# Altium project Kivipallur.PrjPcb
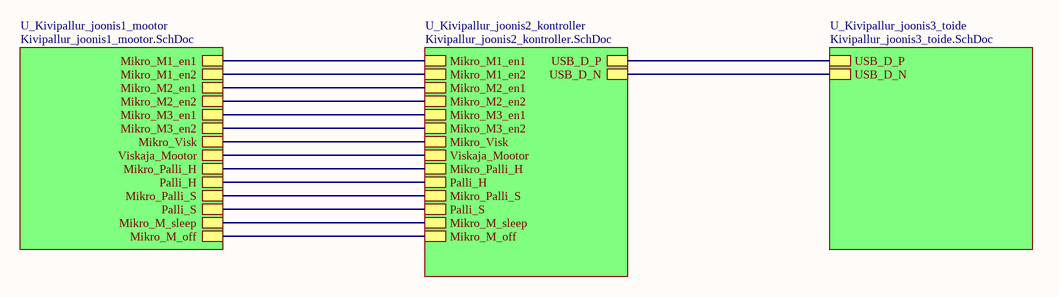
[diagram p0: Kivipallur_joonis4.SchDoc]
4 sheets, 108 parts. Net scope: hierarchical (ports join the sheet entries above them; power ports are global).
Board file: Kivipallur_plaat.PcbDoc
Sheets:
  Kivipallur_joonis4.SchDoc
    U_Kivipallur_joonis1_mootor = Kivipallur_joonis1_mootor.SchDoc
    U_Kivipallur_joonis2_kontroller = Kivipallur_joonis2_kontroller.SchDoc
    U_Kivipallur_joonis3_toide = Kivipallur_joonis3_toide.SchDoc

## Sheet Kivipallur_joonis4.SchDoc
size A4; SheetNumber: 1; SheetTotal: 4

### Sub-sheets
U_Kivipallur_joonis1_mootor = Kivipallur_joonis1_mootor.SchDoc: Mikro_M1_en1, Mikro_M1_en2, Mikro_M2_en1, Mikro_M2_en2, Mikro_M3_en1, Mikro_M3_en2, Mikro_M_sleep, Mikro_M_off, Mikro_Visk, Mikro_Palli_S, Mikro_Palli_H, Viskaja_Mootor, Palli_S, Palli_H
U_Kivipallur_joonis2_kontroller = Kivipallur_joonis2_kontroller.SchDoc: Mikro_M_sleep, Mikro_Visk, Mikro_M3_en2, Mikro_M3_en1, Mikro_M2_en2, Mikro_M2_en1, Mikro_M1_en2, Mikro_M1_en1, Mikro_M_off, USB_D_P, USB_D_N, Viskaja_Mootor, Palli_H, Palli_S, Mikro_Palli_H, Mikro_Palli_S
U_Kivipallur_joonis3_toide = Kivipallur_joonis3_toide.SchDoc: USB_D_P, USB_D_N

### Nets
USB_D_N: sheet U_Kivipallur_joonis2_kontroller/USB_D_N, sheet U_Kivipallur_joonis3_toide/USB_D_N
USB_D_P: sheet U_Kivipallur_joonis2_kontroller/USB_D_P, sheet U_Kivipallur_joonis3_toide/USB_D_P
NetJ9_2: sheet U_Kivipallur_joonis1_mootor/Palli_H, sheet U_Kivipallur_joonis2_kontroller/Palli_H
NetJ11_2: sheet U_Kivipallur_joonis1_mootor/Palli_S, sheet U_Kivipallur_joonis2_kontroller/Palli_S
NetJ14_2: sheet U_Kivipallur_joonis1_mootor/Viskaja_Mootor, sheet U_Kivipallur_joonis2_kontroller/Viskaja_Mootor
NetU4_3: sheet U_Kivipallur_joonis1_mootor/Mikro_Visk, sheet U_Kivipallur_joonis2_kontroller/Mikro_Visk
NetU4_4: sheet U_Kivipallur_joonis1_mootor/Mikro_Palli_S, sheet U_Kivipallur_joonis2_kontroller/Mikro_Palli_S
NetU4_5: sheet U_Kivipallur_joonis1_mootor/Mikro_Palli_H, sheet U_Kivipallur_joonis2_kontroller/Mikro_Palli_H
NetU5_3: sheet U_Kivipallur_joonis1_mootor/Mikro_M1_en1, sheet U_Kivipallur_joonis2_kontroller/Mikro_M1_en1
NetU5_4: sheet U_Kivipallur_joonis1_mootor/Mikro_M1_en2, sheet U_Kivipallur_joonis2_kontroller/Mikro_M1_en2
NetU5_5: sheet U_Kivipallur_joonis1_mootor/Mikro_M2_en1, sheet U_Kivipallur_joonis2_kontroller/Mikro_M2_en1
NetU5_6: sheet U_Kivipallur_joonis1_mootor/Mikro_M2_en2, sheet U_Kivipallur_joonis2_kontroller/Mikro_M2_en2
NetU6_3: sheet U_Kivipallur_joonis1_mootor/Mikro_M3_en1, sheet U_Kivipallur_joonis2_kontroller/Mikro_M3_en1
NetU6_4: sheet U_Kivipallur_joonis1_mootor/Mikro_M3_en2, sheet U_Kivipallur_joonis2_kontroller/Mikro_M3_en2
NetU6_5: sheet U_Kivipallur_joonis1_mootor/Mikro_M_sleep, sheet U_Kivipallur_joonis2_kontroller/Mikro_M_sleep
NetU6_6: sheet U_Kivipallur_joonis1_mootor/Mikro_M_off, sheet U_Kivipallur_joonis2_kontroller/Mikro_M_off

## Sheet Kivipallur_joonis1_mootor.SchDoc
size A4; SheetNumber: 2; SheetTotal: 4
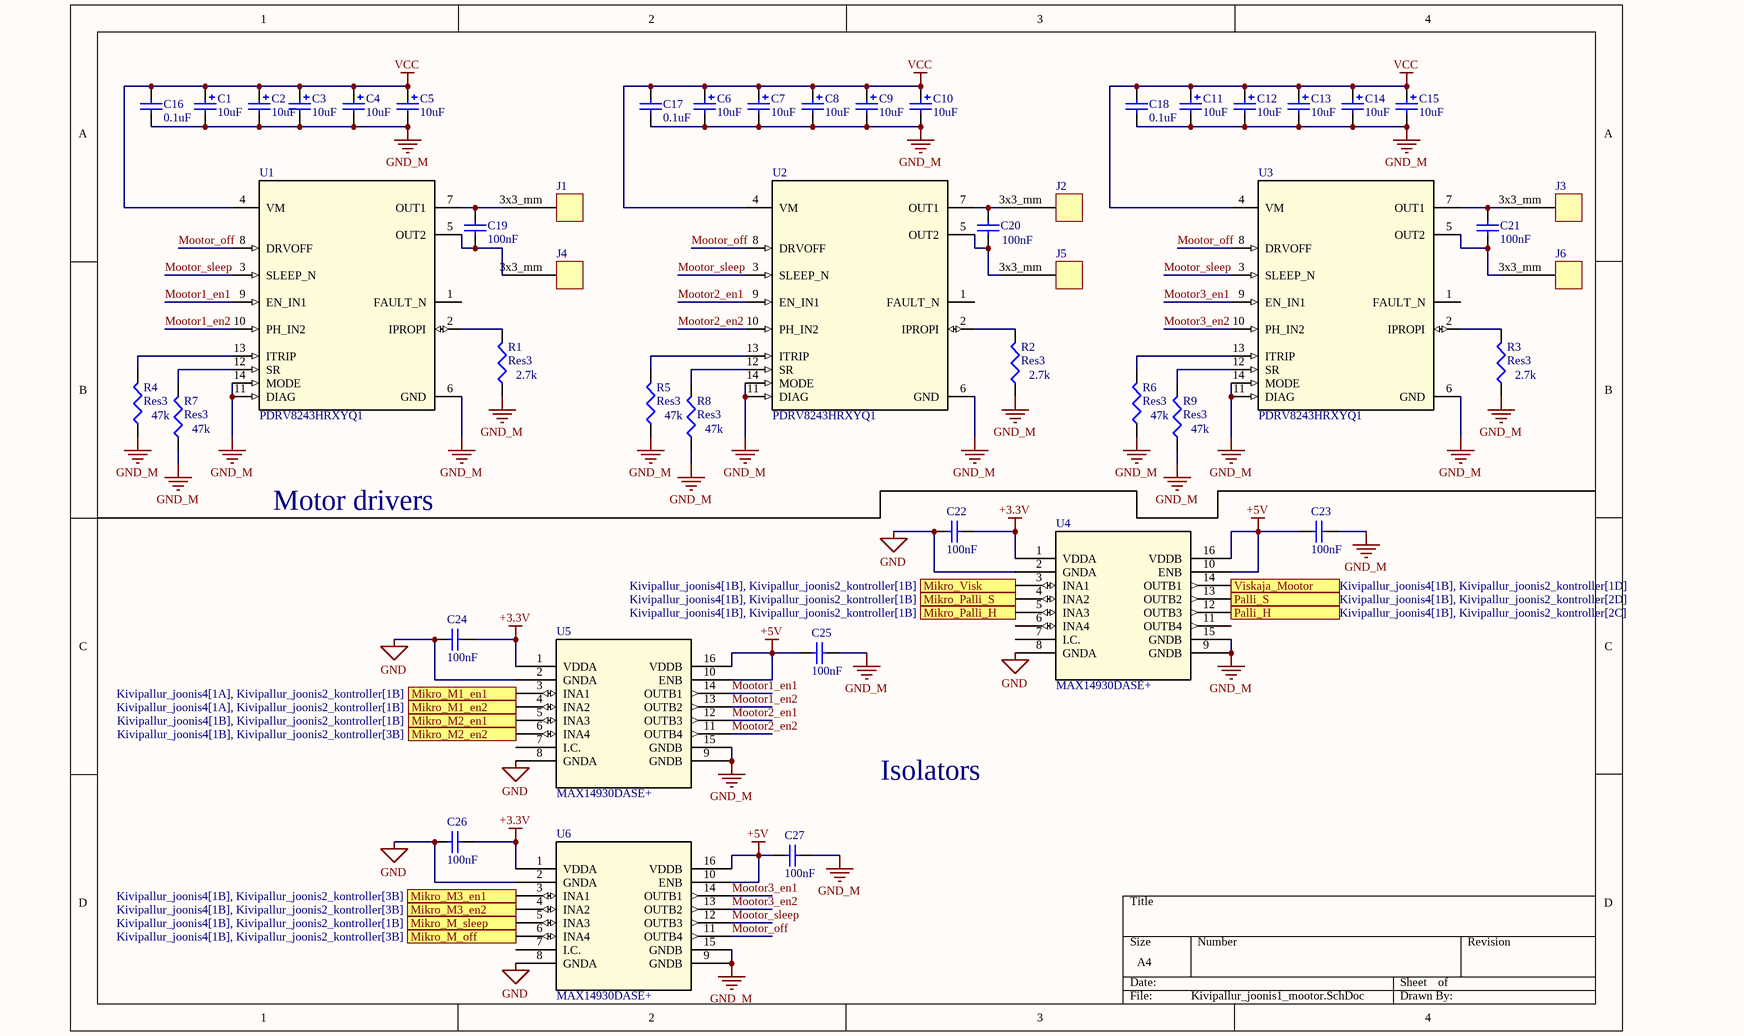
[diagram p1: Kivipallur_joonis1_mootor.SchDoc]

### Parts
C1  value 10uF  [C0805]  (hidden comment: Cap Pol3)
C2  value 10uF  [C0805]  (hidden comment: Cap Pol3)
C3  value 10uF  [C0805]  (hidden comment: Cap Pol3)
C4  value 10uF  [C0805]  (hidden comment: Cap Pol3)
C5  value 10uF  [C0805]  (hidden comment: Cap Pol3)
C6  value 10uF  [C0805]  (hidden comment: Cap Pol3)
C7  value 10uF  [C0805]  (hidden comment: Cap Pol3)
C8  value 10uF  [C0805]  (hidden comment: Cap Pol3)
C9  value 10uF  [C0805]  (hidden comment: Cap Pol3)
C10  value 10uF  [C0805]  (hidden comment: Cap Pol3)
C11  value 10uF  [C0805]  (hidden comment: Cap Pol3)
C12  value 10uF  [C0805]  (hidden comment: Cap Pol3)
C13  value 10uF  [C0805]  (hidden comment: Cap Pol3)
C14  value 10uF  [C0805]  (hidden comment: Cap Pol3)
C15  value 10uF  [C0805]  (hidden comment: Cap Pol3)
C16  value 0.1uF  [1608[0603]]  (hidden comment: Cap Semi)
C17  value 0.1uF  [1608[0603]]  (hidden comment: Cap Semi)
C18  value 0.1uF  [1608[0603]]  (hidden comment: Cap Semi)
C19  value 100nF  [1608[0603]]  (hidden comment: Cap Semi)
C20  value 100nF  [1608[0603]]  (hidden comment: Cap Semi)
C21  value 100nF  [1608[0603]]  (hidden comment: Cap Semi)
C22  value 100nF  [1608[0603]]  (hidden comment: Cap Semi)
C23  value 100nF  [1608[0603]]  (hidden comment: Cap Semi)
C24  value 100nF  [1608[0603]]  (hidden comment: Cap Semi)
C25  value 100nF  [1608[0603]]  (hidden comment: Cap Semi)
C26  value 100nF  [1608[0603]]  (hidden comment: Cap Semi)
C27  value 100nF  [1608[0603]]  (hidden comment: Cap Semi)
J1  3x3_mm  [3x3_mm]  (value not drawn)
J2  3x3_mm  [3x3_mm]  (value not drawn)
J3  3x3_mm  [3x3_mm]  (value not drawn)
J4  3x3_mm  [3x3_mm]  (value not drawn)
J5  3x3_mm  [3x3_mm]  (value not drawn)
J6  3x3_mm  [3x3_mm]  (value not drawn)
R1  Res3  value 2.7k  [J1-0603]
R2  Res3  value 2.7k  [J1-0603]
R3  Res3  value 2.7k  [J1-0603]
R4  Res3  value 47k  [J1-0603]
R5  Res3  value 47k  [J1-0603]
R6  Res3  value 47k  [J1-0603]
R7  Res3  value 47k  [J1-0603]
R8  Res3  value 47k  [J1-0603]
R9  Res3  value 47k  [J1-0603]
U1  PDRV8243HRXYQ1  [RXY0014A-MFG]
U2  PDRV8243HRXYQ1  [RXY0014A-MFG]
U3  PDRV8243HRXYQ1  [RXY0014A-MFG]
U4  MAX14930DASE+  [21-0041_S16+1_MXM]
U5  MAX14930DASE+  [21-0041_S16+1_MXM]
U6  MAX14930DASE+  [21-0041_S16+1_MXM]

### Ports
Mikro_M1_en1 (see Kivipallur_joonis4[1A], Kivipallur_joonis2_kontroller[1B]), Mikro_M1_en2 (see Kivipallur_joonis4[1A], Kivipallur_joonis2_kontroller[1B]), Mikro_M2_en1 (see Kivipallur_joonis4[1B], Kivipallur_joonis2_kontroller[1B]), Mikro_M2_en2 (see Kivipallur_joonis4[1B], Kivipallur_joonis2_kontroller[3B]), Mikro_M3_en1 (see Kivipallur_joonis4[1B], Kivipallur_joonis2_kontroller[3B]), Mikro_M3_en2 (see Kivipallur_joonis4[1B], Kivipallur_joonis2_kontroller[3B]), Mikro_M_off (see Kivipallur_joonis4[1B], Kivipallur_joonis2_kontroller[3B]), Mikro_M_sleep (see Kivipallur_joonis4[1B], Kivipallur_joonis2_kontroller[1B]), Mikro_Palli_H (see Kivipallur_joonis4[1B], Kivipallur_joonis2_kontroller[1B]), Mikro_Palli_S (see Kivipallur_joonis4[1B], Kivipallur_joonis2_kontroller[1B]), Mikro_Visk (see Kivipallur_joonis4[1B], Kivipallur_joonis2_kontroller[1B]), Palli_H (see Kivipallur_joonis4[1B], Kivipallur_joonis2_kontroller[2C]), Palli_S (see Kivipallur_joonis4[1B], Kivipallur_joonis2_kontroller[2D]), Viskaja_Mootor (see Kivipallur_joonis4[1B], Kivipallur_joonis2_kontroller[1D])

### Nets
+3.3V: C22.2 C24.2 C26.2 U4.1(VDDA) U5.1(VDDA) U6.1(VDDA)
+5V: C23.1 C25.1 C27.1 U4.10(ENB) U4.16(VDDB) U5.10(ENB) U5.16(VDDB) U6.10(ENB) U6.16(VDDB)
GND: C22.1 C24.1 C26.1 U4.2(GNDA) U4.8(GNDA) U5.2(GNDA) U5.8(GNDA) U6.2(GNDA) U6.8(GNDA)
GND_M: C1.2 C2.2 C3.2 C4.2 C5.2 C6.2 C7.2 C8.2 C9.2 C10.2 C11.2 C12.2 C13.2 C14.2 C15.2 C16.1 C17.1 C18.1 C23.2 C25.2 C27.2 R1.1 R2.1 R3.1 R4.1 R5.1 R6.1 R7.1 R8.1 R9.1 U1.6(GND) U1.11(DIAG) U1.14(MODE) U2.6(GND) U2.11(DIAG) U2.14(MODE) U3.6(GND) U3.11(DIAG) U3.14(MODE) U4.9(GNDB) U4.15(GNDB) U5.9(GNDB) U5.15(GNDB) U6.9(GNDB) U6.15(GNDB)
VCC: C1.1 C2.1 C3.1 C4.1 C5.1 C6.1 C7.1 C8.1 C9.1 C10.1 C11.1 C12.1 C13.1 C14.1 C15.1 C16.2 C17.2 C18.2 U1.4(VM) U2.4(VM) U3.4(VM)
Mootor1_en1: U1.9(EN_IN1) U5.14(OUTB1)
Mootor1_en2: U1.10(PH_IN2) U5.13(OUTB2)
Mootor2_en1: U2.9(EN_IN1) U5.12(OUTB3)
Mootor2_en2: U2.10(PH_IN2) U5.11(OUTB4)
Mootor3_en1: U3.9(EN_IN1) U6.14(OUTB1)
Mootor3_en2: U3.10(PH_IN2) U6.13(OUTB2)
Mootor_off: U1.8(DRVOFF) U2.8(DRVOFF) U3.8(DRVOFF) U6.11(OUTB4)
Mootor_sleep: U1.3(SLEEP_N) U2.3(SLEEP_N) U3.3(SLEEP_N) U6.12(OUTB3)
NetC19_1: C19.1 J4.3x3_mm U1.5(OUT2)
NetC19_2: C19.2 J1.3x3_mm U1.7(OUT1)
NetC20_1: C20.1 J5.3x3_mm U2.5(OUT2)
NetC20_2: C20.2 J2.3x3_mm U2.7(OUT1)
NetC21_1: C21.1 J6.3x3_mm U3.5(OUT2)
NetC21_2: C21.2 J3.3x3_mm U3.7(OUT1)
NetJ9_2: U4.12(OUTB3) ; port Palli_H
NetJ11_2: U4.13(OUTB2) ; port Palli_S
NetJ14_2: U4.14(OUTB1) ; port Viskaja_Mootor
NetR1_2: R1.2 U1.2(IPROPI)
NetR2_2: R2.2 U2.2(IPROPI)
NetR3_2: R3.2 U3.2(IPROPI)
NetR4_2: R4.2 U1.13(ITRIP)
NetR5_2: R5.2 U2.13(ITRIP)
NetR6_2: R6.2 U3.13(ITRIP)
NetR7_2: R7.2 U1.12(SR)
NetR8_2: R8.2 U2.12(SR)
NetR9_2: R9.2 U3.12(SR)
NetU4_3: U4.3(INA1) ; port Mikro_Visk
NetU4_4: U4.4(INA2) ; port Mikro_Palli_S
NetU4_5: U4.5(INA3) ; port Mikro_Palli_H
NetU5_3: U5.3(INA1) ; port Mikro_M1_en1
NetU5_4: U5.4(INA2) ; port Mikro_M1_en2
NetU5_5: U5.5(INA3) ; port Mikro_M2_en1
NetU5_6: U5.6(INA4) ; port Mikro_M2_en2
NetU6_3: U6.3(INA1) ; port Mikro_M3_en1
NetU6_4: U6.4(INA2) ; port Mikro_M3_en2
NetU6_5: U6.5(INA3) ; port Mikro_M_sleep
NetU6_6: U6.6(INA4) ; port Mikro_M_off

Not connected (* = marked no-connect by the designer): U1 1(FAULT_N); U2 1(FAULT_N); U3 1(FAULT_N); U4 6(INA4) 7(I.C.) 11(OUTB4); U5 7(I.C.); U6 7(I.C.)

### Notes on the sheet
- Motor drivers
- Isolators

### Library data of the parts
C1-C15 = Cap Pol3: Polarized Capacitor (Surface Mount); Published: 8-Jun-2000; PackageReference: C0805; Publisher: Altium Limited; PackageDescription: Chip Capacitor; LatestRevisionDate: 29-May-2009; LatestRevisionNote: IPC-7351 Footprint Added.
C16-C27 = Cap Semi: Capacitor (Semiconductor SIM Model); Published: 8-Jun-2000; PackageReference: C1206; Publisher: Altium Limited; PackageDescription: Chip Capacitor; LatestRevisionDate: 29-May-2009; LatestRevisionNote: IPC-7351 Footprint Added.
R1-R9 = Res3: Resistor; Published: 8-Jun-2000; LatestRevisionDate: 29-May-2009; LatestRevisionNote: IPC-7351 Footprint Added.; PackageReference: J1-0603; Publisher: Altium Limited; PackageDescription: Chip Resistor
U1-U3 = PDRV8243HRXYQ1: No Description Available; Mfr_Name: Texas Instruments; Type: DEV; RefDes: RefDes; Copyright: Copyright (C) 2022 Ultra Librarian. All rights reserved.; Manufacturer_Part_Number: PDRV8243HRXYQ1
U4-U6 = MAX14930DASE+_1: No Description Available; Mfr_Name: Maxim Integrated Products; Copyright: Copyright (C) 2022 Ultra Librarian. All rights reserved.; Manufacturer_Part_Number: MAX14930DASE+; RefDes: RefDes; Type: DEV

## Sheet Kivipallur_joonis2_kontroller.SchDoc
size A4; SheetNumber: 3; SheetTotal: 4; SPICEModelCacheWOZQSQAE: <root> / <DocumentId>WOZQSQAE</DocumentId> / </root>
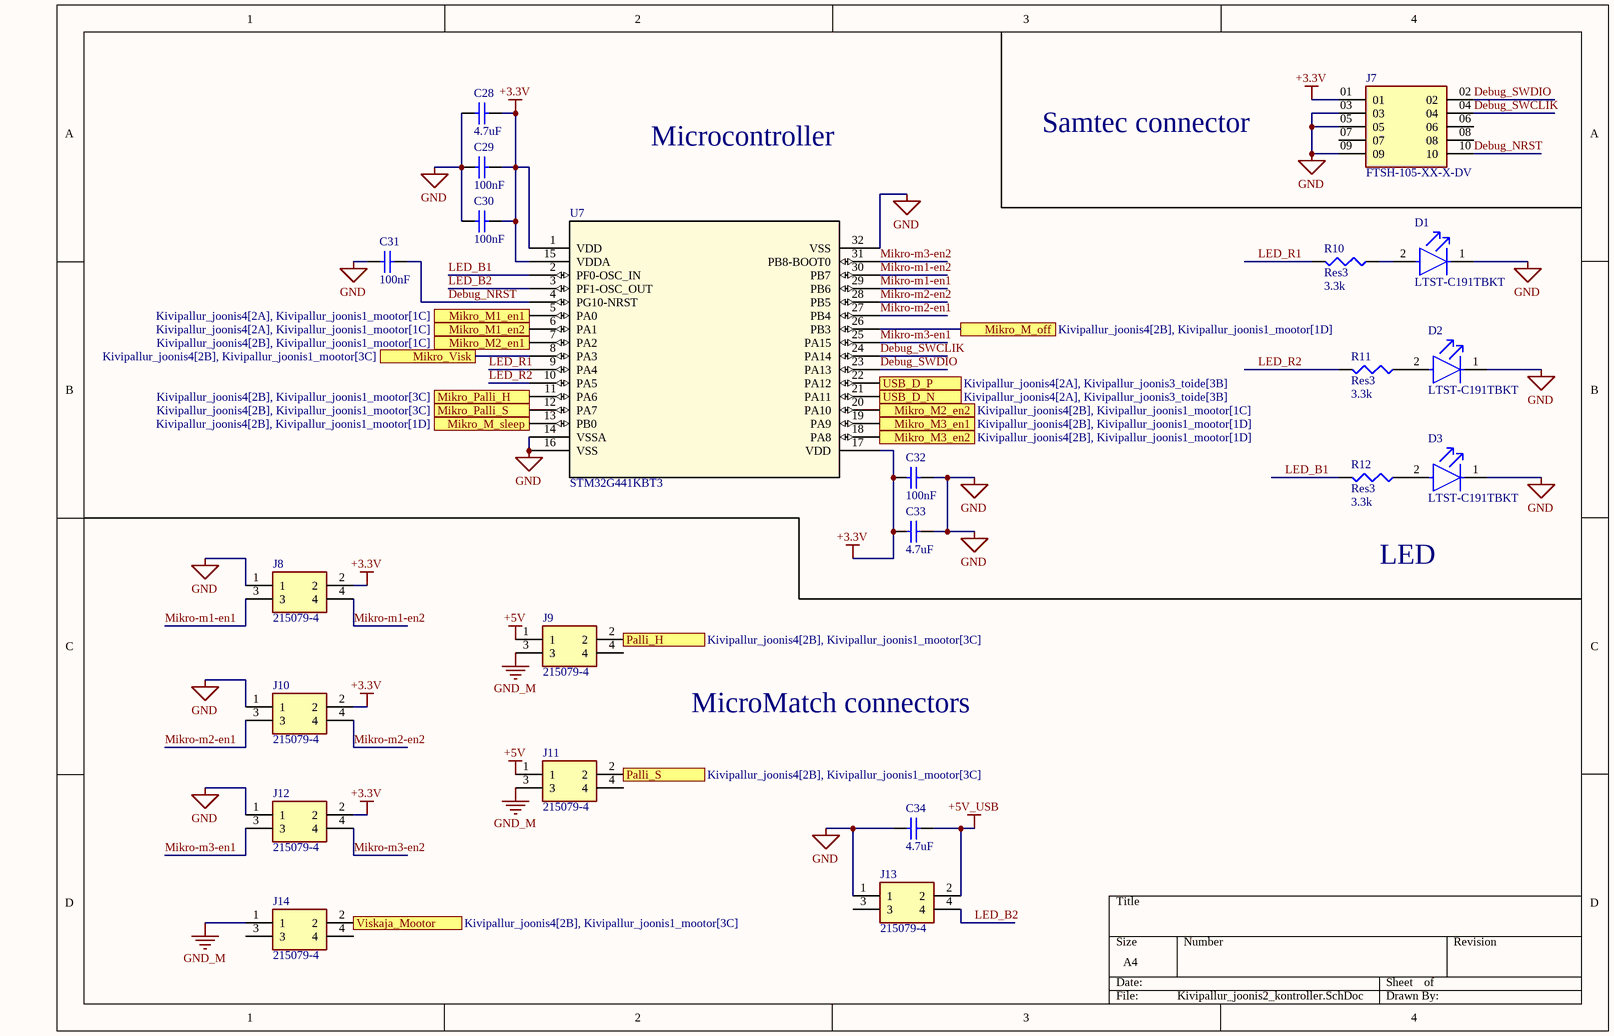
[diagram p2: Kivipallur_joonis2_kontroller.SchDoc]

### Parts
C28  value 4.7uF  [1608[0603]]  (hidden comment: Cap Semi)
C29  value 100nF  [1608[0603]]  (hidden comment: Cap Semi)
C30  value 100nF  [1608[0603]]  (hidden comment: Cap Semi)
C31  value 100nF  [1608[0603]]  (hidden comment: Cap Semi)
C32  value 100nF  [1608[0603]]  (hidden comment: Cap Semi)
C33  value 4.7uF  [1608[0603]]  (hidden comment: Cap Semi)
C34  value 4.7uF  [1608[0603]]  (hidden comment: Cap Semi)
D1  LTST-C191TBKT  [FP-LTST-C191TBKT-MFG]
D2  LTST-C191TBKT  [FP-LTST-C191TBKT-MFG]
D3  LTST-C191TBKT  [FP-LTST-C191TBKT-MFG]
J7  FTSH-105-XX-X-DV  [SAMTEC_FTSH-105-XX-X-DV]
J8  215079-4  [TE_215079-4]
J9  215079-4  [TE_215079-4]
J10  215079-4  [TE_215079-4]
J11  215079-4  [TE_215079-4]
J12  215079-4  [TE_215079-4]
J13  215079-4  [TE_215079-4]
J14  215079-4  [TE_215079-4]
R10  Res3  value 3.3k  [J1-0603]
R11  Res3  value 3.3k  [J1-0603]
R12  Res3  value 3.3k  [J1-0603]
U7  STM32G441KBT3  [LQFP32_7X7_STM]

### Ports
Mikro_M1_en1 (see Kivipallur_joonis4[2A], Kivipallur_joonis1_mootor[1C]), Mikro_M1_en2 (see Kivipallur_joonis4[2A], Kivipallur_joonis1_mootor[1C]), Mikro_M2_en1 (see Kivipallur_joonis4[2B], Kivipallur_joonis1_mootor[1C]), Mikro_M2_en2 (see Kivipallur_joonis4[2B], Kivipallur_joonis1_mootor[1C]), Mikro_M3_en1 (see Kivipallur_joonis4[2B], Kivipallur_joonis1_mootor[1D]), Mikro_M3_en2 (see Kivipallur_joonis4[2B], Kivipallur_joonis1_mootor[1D]), Mikro_M_off (see Kivipallur_joonis4[2B], Kivipallur_joonis1_mootor[1D]), Mikro_M_sleep (see Kivipallur_joonis4[2B], Kivipallur_joonis1_mootor[1D]), Mikro_Palli_H (see Kivipallur_joonis4[2B], Kivipallur_joonis1_mootor[3C]), Mikro_Palli_S (see Kivipallur_joonis4[2B], Kivipallur_joonis1_mootor[3C]), Mikro_Visk (see Kivipallur_joonis4[2B], Kivipallur_joonis1_mootor[3C]), Palli_H (see Kivipallur_joonis4[2B], Kivipallur_joonis1_mootor[3C]), Palli_S (see Kivipallur_joonis4[2B], Kivipallur_joonis1_mootor[3C]), USB_D_N (see Kivipallur_joonis4[2A], Kivipallur_joonis3_toide[3B]), USB_D_P (see Kivipallur_joonis4[2A], Kivipallur_joonis3_toide[3B]), Viskaja_Mootor (see Kivipallur_joonis4[2B], Kivipallur_joonis1_mootor[3C])

### Nets
+3.3V: C28.2 C29.2 C30.2 C32.1 C33.1 J7.01 J8.2 J10.2 J12.2 U7.1(VDD) U7.15(VDDA) U7.17(VDD)
+5V: J9.1 J11.1
+5V_USB: C34.1 J13.2
GND: C28.1 C29.1 C30.1 C31.1 C32.2 C33.2 C34.2 D1.1(C) D2.1(C) D3.1(C) J7.03 J7.05 J7.09 J8.1 J10.1 J12.1 J13.1 U7.14(VSSA) U7.16(VSS) U7.32(VSS)
GND_M: J9.3 J11.3 J14.1
Debug_NRST: C31.2 J7.10 U7.4(PG10-NRST)
Debug_SWCLIK: J7.04 U7.24(PA14)
Debug_SWDIO: J7.02 U7.23(PA13)
LED_B1: R12.2 U7.2(PF0-OSC_IN)
LED_B2: J13.4 U7.3(PF1-OSC_OUT)
LED_R1: R10.2 U7.9(PA4)
LED_R2: R11.2 U7.10(PA5)
Mikro-m1-en1: J8.3 U7.29(PB6)
Mikro-m1-en2: J8.4 U7.30(PB7)
Mikro-m2-en1: J10.3 U7.27(PB4)
Mikro-m2-en2: J10.4 U7.28(PB5)
Mikro-m3-en1: J12.3 U7.25(PA15)
Mikro-m3-en2: J12.4 U7.31(PB8-BOOT0)
USB_D_N: U7.21(PA11) ; port USB_D_N
USB_D_P: U7.22(PA12) ; port USB_D_P
NetD1_2: D1.2(A) R10.1
NetD2_2: D2.2(A) R11.1
NetD3_2: D3.2(A) R12.1
NetJ9_2: J9.2 ; port Palli_H
NetJ11_2: J11.2 ; port Palli_S
NetJ14_2: J14.2 ; port Viskaja_Mootor
NetU4_3: U7.8(PA3) ; port Mikro_Visk
NetU4_4: U7.12(PA7) ; port Mikro_Palli_S
NetU4_5: U7.11(PA6) ; port Mikro_Palli_H
NetU5_3: U7.5(PA0) ; port Mikro_M1_en1
NetU5_4: U7.6(PA1) ; port Mikro_M1_en2
NetU5_5: U7.7(PA2) ; port Mikro_M2_en1
NetU5_6: U7.20(PA10) ; port Mikro_M2_en2
NetU6_3: U7.19(PA9) ; port Mikro_M3_en1
NetU6_4: U7.18(PA8) ; port Mikro_M3_en2
NetU6_5: U7.13(PB0) ; port Mikro_M_sleep
NetU6_6: U7.26(PB3) ; port Mikro_M_off

Not connected (* = marked no-connect by the designer): J7 06 07 08; J9 4; J11 4; J13 3; J14 3 4

### Notes on the sheet
- Microcontroller
- Samtec connector
- LED
- MicroMatch connectors

### Library data of the parts
C28-C34 = Cap Semi: Capacitor (Semiconductor SIM Model); Published: 8-Jun-2000; PackageReference: C1206; Publisher: Altium Limited; PackageDescription: Chip Capacitor; LatestRevisionDate: 29-May-2009; LatestRevisionNote: IPC-7351 Footprint Added.
D1-D3 = CMP-22017-000008-1: LED BLUE CLEAR CHIP SMD; Lens Color: Colorless; Dominant Wavelength: 475nm; Forward Current: 20mA; Wavelength: 468nm; Viewing Angle: 130°; Power Dissipation: 76mW; Luminous Intensity: 180mcd; Reverse Voltage: 5V; Number of Elements: 1; Lens Style: Diffused; Forward Voltage: 3.8V; Max Power Dissipation: 75mW; Case Code (Metric): 1608; Packaging: Tape and Reel; Case/Package: 0603; Depth: 1.6mm; Mount: Surface Mount; Lead Free: Lead Free; Min Operating Temperature: -20°C; Lens Transparency: Clear; Illumination Color: Blue; Height: 0.55mm; Test Current: 20mA; Case Code (Imperial): 0603; Max Operating Temperature: 80°C; Number of Pins: 2; Length: 0.8mm; Radiation Hardening: No; Package Quantity: 1; Number of LEDs: 1; Width: 0.8mm; Color: Blue
J7 = FTSH-105-XX-X-DV: Connector Header Surface Mount 10 position 0.050" (1.27mm); Availability: Unavailable; Package: None; MP: FTSH-105-XX-X-DV; Price: None; Value: *
J8-J14 = 215079-4: 4 Position Receptacle Connector Through Hole; MF: TE Connectivity; Price: None; Availability: Unavailable; SnapEDA_Link: https://www.snapeda.com/parts/215079-4/TE%20Connectivity%20AMP%20Connectors/view-part/2366486/?ref=snap; EU_RoHS_Compliance: Compliant; Value: *; MP: 215079-4; TE_purchase_URL: https://www.te.com/usa-en/product-215079-4.html?te_bu=Cor&te_type=disp&te_campaign=seda_glo_cor-seda-global-disp-prtnr-fy19-seda-model-bom-cta_sma-317_1&elqCampaignId=32493; Package: SMD-6 Omron Electronics
R10-R12 = Res3: Resistor; Published: 8-Jun-2000; LatestRevisionDate: 29-May-2009; LatestRevisionNote: IPC-7351 Footprint Added.; PackageReference: J1-0603; Publisher: Altium Limited; PackageDescription: Chip Resistor
U7 = STM32G441KBT3: No Description Available; Mfr_Name: STMicroelectronics; Copyright: Copyright (C) 2022 Ultra Librarian. All rights reserved.; Manufacturer_Part_Number: STM32G441KBT3; RefDes: RefDes; Type: DEV

## Sheet Kivipallur_joonis3_toide.SchDoc
size A4; SheetNumber: 4; SheetTotal: 4
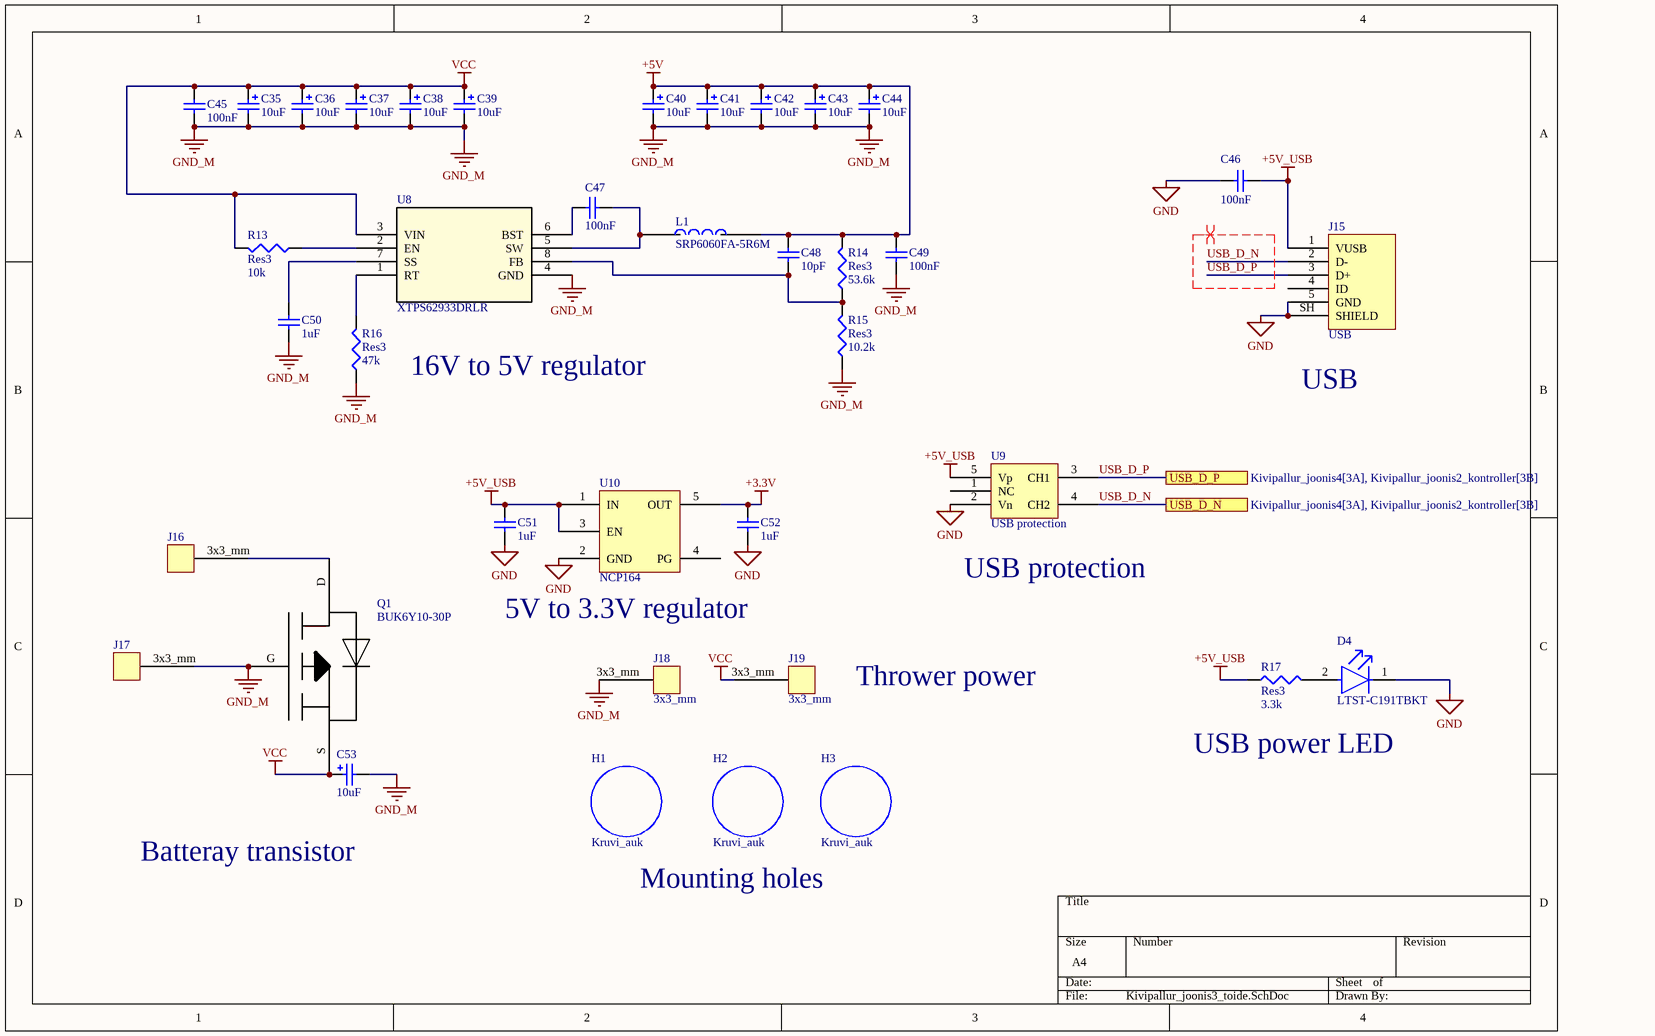
[diagram p3: Kivipallur_joonis3_toide.SchDoc]

### Parts
C35  value 10uF  [C0805]  (hidden comment: Cap Pol3)
C36  value 10uF  [C0805]  (hidden comment: Cap Pol3)
C37  value 10uF  [C0805]  (hidden comment: Cap Pol3)
C38  value 10uF  [C0805]  (hidden comment: Cap Pol3)
C39  value 10uF  [C0805]  (hidden comment: Cap Pol3)
C40  value 10uF  [C0805]  (hidden comment: Cap Pol3)
C41  value 10uF  [C0805]  (hidden comment: Cap Pol3)
C42  value 10uF  [C0805]  (hidden comment: Cap Pol3)
C43  value 10uF  [C0805]  (hidden comment: Cap Pol3)
C44  value 10uF  [C0805]  (hidden comment: Cap Pol3)
C45  value 100nF  [1608[0603]]  (hidden comment: Cap Semi)
C46  value 100nF  [1608[0603]]  (hidden comment: Cap Semi)
C47  value 100nF  [1608[0603]]  (hidden comment: Cap Semi)
C48  value 10pF  [1608[0603]]  (hidden comment: Cap Semi)
C49  value 100nF  [1608[0603]]  (hidden comment: Cap Semi)
C50  value 1uF  [1608[0603]]  (hidden comment: Cap Semi)
C51  value 1uF  [1608[0603]]  (hidden comment: Cap Semi)
C52  value 1uF  [1608[0603]]  (hidden comment: Cap Semi)
C53  value 10uF  [C0805]  (hidden comment: Cap Pol3)
D4  LTST-C191TBKT  [FP-LTST-C191TBKT-MFG]
H1  Kruvi_auk  [kruvi_auk]
H2  Kruvi_auk  [kruvi_auk]
H3  Kruvi_auk  [kruvi_auk]
J15  USB  [USB]
J16  3x3_mm  [3x3_mm]  (value not drawn)
J17  3x3_mm  [3x3_mm]  (value not drawn)
J18  3x3_mm  [3x3_mm]
J19  3x3_mm  [3x3_mm]
L1  SRP6060FA-5R6M  [test alus]
Q1  BUK6Y10-30P  [BUK6Y10-30P]
R13  Res3  value 10k  [J1-0603]
R14  Res3  value 53.6k  [J1-0603]
R15  Res3  value 10.2k  [J1-0603]
R16  Res3  value 47k  [J1-0603]
R17  Res3  value 3.3k  [J1-0603]
U8  XTPS62933DRLR  [SOT_33DRLR_TEX]
U9  USB protection  [USB_PROTECTION_3]
U10  NCP164  [NCP164_2]

### Ports
USB_D_N (see Kivipallur_joonis4[3A], Kivipallur_joonis2_kontroller[3B]), USB_D_P (see Kivipallur_joonis4[3A], Kivipallur_joonis2_kontroller[3B])

### Nets
+3.3V: C52.1 U10.5(OUT)
+5V: C40.1 C41.1 C42.1 C43.1 C44.1 C48.1 C49.1 L1.2 R14.2
+5V_USB: C46.1 C51.1 J15.1(VUSB) R17.1 U9.5(Vp) U10.1(IN) U10.3(EN)
GND: C46.2 C51.2 C52.2 D4.1(C) J15.5(GND) J15.SH(SHIELD) U9.2(Vn) U10.2(GND)
GND_M: C35.2 C36.2 C37.2 C38.2 C39.2 C40.2 C41.2 C42.2 C43.2 C44.2 C45.2 C49.2 C50.2 C53.2 J17.3x3_mm J18.3x3_mm Q1.G R15.1 R16.1 U8.4(GND)
VCC: C35.1 C36.1 C37.1 C38.1 C39.1 C45.1 C53.1 J19.3x3_mm Q1.S R13.2 U8.3(VIN)
USB_D_N: J15.2(D-) U9.4(CH2) ; port USB_D_N
USB_D_P: J15.3(D+) U9.3(CH1) ; port USB_D_P
NetC47_1: C47.1 U8.6(BST)
NetC47_2: C47.2 L1.1 U8.5(SW)
NetC48_2: C48.2 R14.1 R15.2 U8.8(FB)
NetC50_1: C50.1 U8.7(SS)
NetD4_2: D4.2(A) R17.2
NetJ16_3x3_mm: J16.3x3_mm Q1.D
NetR13_1: R13.1 U8.2(EN)
NetR16_2: R16.2 U8.1(RT)

Not connected (* = marked no-connect by the designer): J15 4(ID); U9 1(NC); U10 4(PG)

### Layout directives
differential pair; differential pair class USB: USB_D_N, USB_D_P

### Notes on the sheet
- 16V to 5V regulator
- (near J15) USB
- (near U9) USB protection
- 5V to 3.3V regulator
- Thrower power
- USB power LED
- Batteray transistor
- Mounting holes

### Library data of the parts
C35-C44 C53 = Cap Pol3: Polarized Capacitor (Surface Mount); Published: 8-Jun-2000; PackageReference: C0805; Publisher: Altium Limited; PackageDescription: Chip Capacitor; LatestRevisionDate: 29-May-2009; LatestRevisionNote: IPC-7351 Footprint Added.
C45-C52 = Cap Semi: Capacitor (Semiconductor SIM Model); Published: 8-Jun-2000; PackageReference: C1206; Publisher: Altium Limited; PackageDescription: Chip Capacitor; LatestRevisionDate: 29-May-2009; LatestRevisionNote: IPC-7351 Footprint Added.
D4 = CMP-22017-000008-1: as D1 on sheet Kivipallur_joonis2_kontroller; Case Code (Metric): 1608; Packaging: Tape and Reel; Case/Package: 0603; Depth: 1.6mm; Mount: Surface Mount; Lead Free: Lead Free; Min Operating Temperature: -20°C; Lens Transparency: Clear; Illumination Color: Blue; Height: 0.55mm; Test Current: 20mA; Case Code (Imperial): 0603; Max Operating Temperature: 80°C; Number of Pins: 2; Length: 0.8mm; Radiation Hardening: No; Package Quantity: 1; Number of LEDs: 1; Width: 0.8mm; Color: Blue
R13-R17 = Res3: Resistor; Published: 8-Jun-2000; LatestRevisionDate: 29-May-2009; LatestRevisionNote: IPC-7351 Footprint Added.; PackageReference: J1-0603; Publisher: Altium Limited; PackageDescription: Chip Resistor
U8 = XTPS62933DRLR: No Description Available; Mfr_Name: Texas Instruments; Copyright: Copyright (C) 2022 Ultra Librarian. All rights reserved.; Manufacturer_Part_Number: XTPS62933DRLR; RefDes: RefDes; Type: DEV

## Nets that join several sheets
+3.3V: Kivipallur_joonis1_mootor (6 pins), Kivipallur_joonis2_kontroller (12 pins), Kivipallur_joonis3_toide (C52.1 U10.5)
+5V: Kivipallur_joonis1_mootor (9 pins), Kivipallur_joonis2_kontroller (J9.1 J11.1), Kivipallur_joonis3_toide (9 pins)
+5V_USB: Kivipallur_joonis2_kontroller (C34.1 J13.2), Kivipallur_joonis3_toide (7 pins)
GND: Kivipallur_joonis1_mootor (9 pins), Kivipallur_joonis2_kontroller (20 pins), Kivipallur_joonis3_toide (8 pins)
GND_M: Kivipallur_joonis1_mootor (45 pins), Kivipallur_joonis2_kontroller (J9.3 J11.3 J14.1), Kivipallur_joonis3_toide (20 pins)
VCC: Kivipallur_joonis1_mootor (21 pins), Kivipallur_joonis3_toide (11 pins)
NetJ9_2: Kivipallur_joonis1_mootor (U4.12), Kivipallur_joonis2_kontroller (J9.2)
NetJ11_2: Kivipallur_joonis1_mootor (U4.13), Kivipallur_joonis2_kontroller (J11.2)
NetJ14_2: Kivipallur_joonis1_mootor (U4.14), Kivipallur_joonis2_kontroller (J14.2)
NetU4_3: Kivipallur_joonis1_mootor (U4.3), Kivipallur_joonis2_kontroller (U7.8)
NetU4_4: Kivipallur_joonis1_mootor (U4.4), Kivipallur_joonis2_kontroller (U7.12)
NetU4_5: Kivipallur_joonis1_mootor (U4.5), Kivipallur_joonis2_kontroller (U7.11)
NetU5_3: Kivipallur_joonis1_mootor (U5.3), Kivipallur_joonis2_kontroller (U7.5)
NetU5_4: Kivipallur_joonis1_mootor (U5.4), Kivipallur_joonis2_kontroller (U7.6)
NetU5_5: Kivipallur_joonis1_mootor (U5.5), Kivipallur_joonis2_kontroller (U7.7)
NetU5_6: Kivipallur_joonis1_mootor (U5.6), Kivipallur_joonis2_kontroller (U7.20)
NetU6_3: Kivipallur_joonis1_mootor (U6.3), Kivipallur_joonis2_kontroller (U7.19)
NetU6_4: Kivipallur_joonis1_mootor (U6.4), Kivipallur_joonis2_kontroller (U7.18)
NetU6_5: Kivipallur_joonis1_mootor (U6.5), Kivipallur_joonis2_kontroller (U7.13)
NetU6_6: Kivipallur_joonis1_mootor (U6.6), Kivipallur_joonis2_kontroller (U7.26)
USB_D_N: Kivipallur_joonis2_kontroller (U7.21), Kivipallur_joonis3_toide (J15.2 U9.4)
USB_D_P: Kivipallur_joonis2_kontroller (U7.22), Kivipallur_joonis3_toide (J15.3 U9.3)